# EAGLE schematic cblockyeesh (EAGLE 6.6.0)
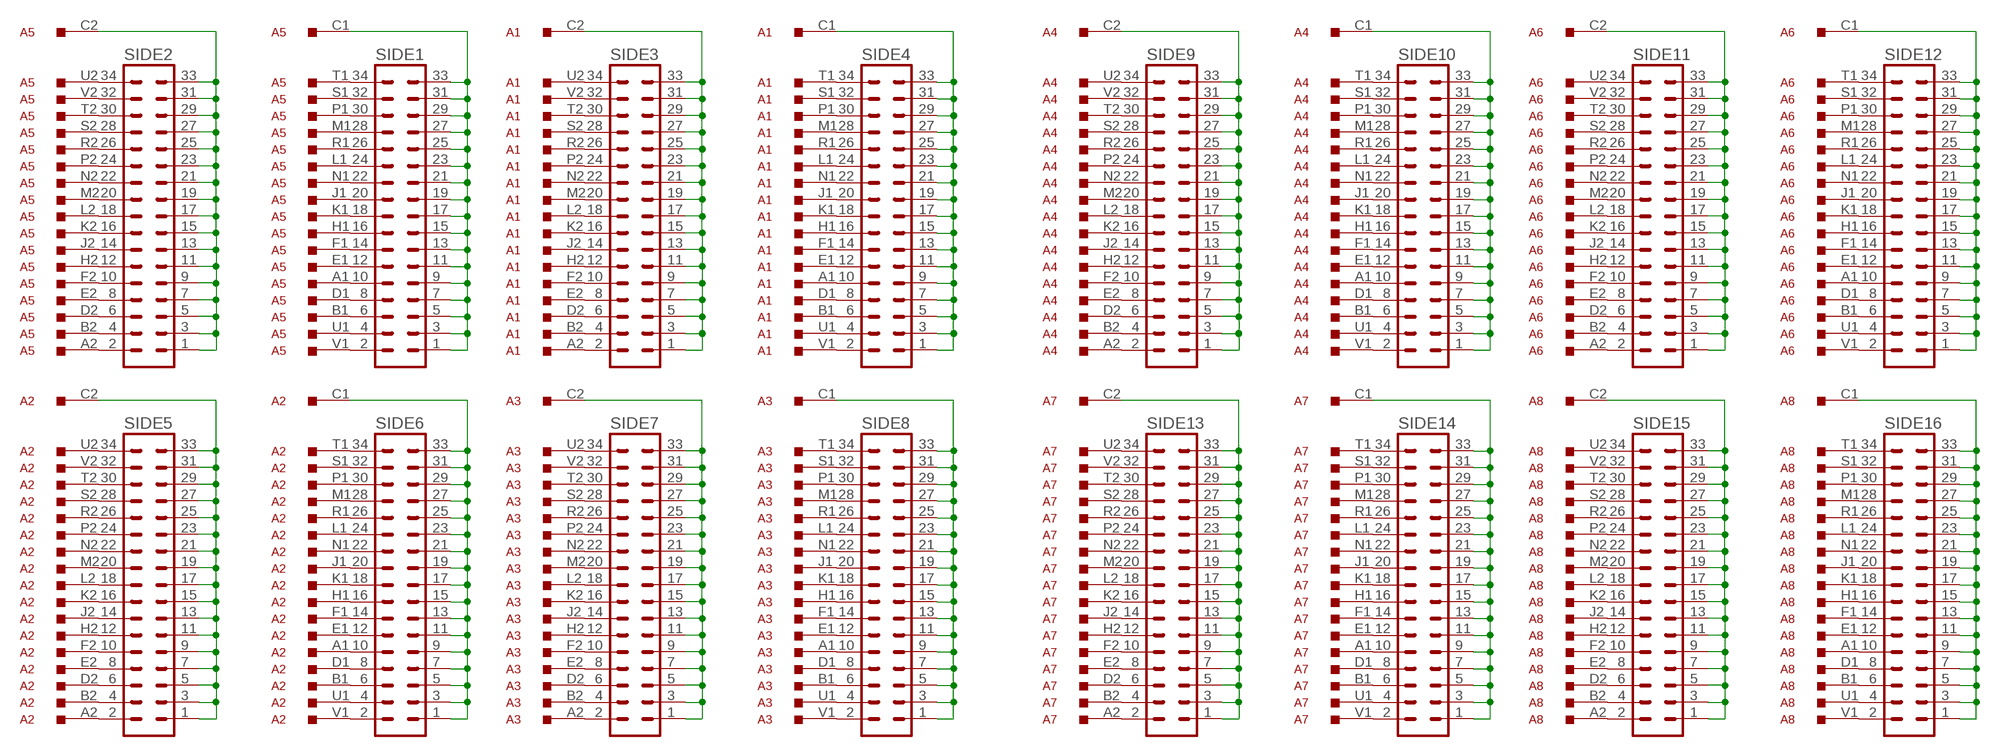
[diagram p0: schematic, sheet 1]

## Parts
A1  M916  [H807]
A2  M916  [H807]
A3  M916  [H807]
A4  M916  [H807]
A5  M916  [H807]
A6  M916  [H807]
A7  M916  [H807]
A8  M916  [H807]
SIDE1  MA17-2  [MA17-2]
SIDE2  MA17-2  [MA17-2]
SIDE3  MA17-2  [MA17-2]
SIDE4  MA17-2  [MA17-2]
SIDE5  MA17-2  [MA17-2]
SIDE6  MA17-2  [MA17-2]
SIDE7  MA17-2  [MA17-2]
SIDE8  MA17-2  [MA17-2]
SIDE9  MA17-2  [MA17-2]
SIDE10  MA17-2  [MA17-2]
SIDE11  MA17-2  [MA17-2]
SIDE12  MA17-2  [MA17-2]
SIDE13  MA17-2  [MA17-2]
SIDE14  MA17-2  [MA17-2]
SIDE15  MA17-2  [MA17-2]
SIDE16  MA17-2  [MA17-2]

## Nets
N$1: A5.C2 SIDE2.1 SIDE2.3 SIDE2.5 SIDE2.7 SIDE2.9 SIDE2.11 SIDE2.13 SIDE2.15 SIDE2.17 SIDE2.19 SIDE2.21 SIDE2.23 SIDE2.25 SIDE2.27 SIDE2.29 SIDE2.31 SIDE2.33
N$2: A5.A2 SIDE2.2
N$3: A5.B2 SIDE2.4
N$4: A5.D2 SIDE2.6
N$5: A5.E2 SIDE2.8
N$6: A5.F2 SIDE2.10
N$7: A5.H2 SIDE2.12
N$8: A5.J2 SIDE2.14
N$9: A5.K2 SIDE2.16
N$10: A5.L2 SIDE2.18
N$11: A5.M2 SIDE2.20
N$12: A5.N2 SIDE2.22
N$13: A5.P2 SIDE2.24
N$14: A5.R2 SIDE2.26
N$15: A5.S2 SIDE2.28
N$16: A5.T2 SIDE2.30
N$17: A5.U2 SIDE2.34
N$18: A5.V2 SIDE2.32
N$19: A5.A1 SIDE1.10
N$20: A5.B1 SIDE1.6
N$21: A5.D1 SIDE1.8
N$22: A5.E1 SIDE1.12
N$23: A5.F1 SIDE1.14
N$24: A5.H1 SIDE1.16
N$25: A5.J1 SIDE1.20
N$26: A5.K1 SIDE1.18
N$27: A5.L1 SIDE1.24
N$28: A5.M1 SIDE1.28
N$29: A5.N1 SIDE1.22
N$30: A5.P1 SIDE1.30
N$31: A5.R1 SIDE1.26
N$32: A5.S1 SIDE1.32
N$33: A5.T1 SIDE1.34
N$34: A5.U1 SIDE1.4
N$35: A5.V1 SIDE1.2
N$36: A5.C1 SIDE1.1 SIDE1.3 SIDE1.5 SIDE1.7 SIDE1.9 SIDE1.11 SIDE1.13 SIDE1.15 SIDE1.17 SIDE1.19 SIDE1.21 SIDE1.23 SIDE1.25 SIDE1.27 SIDE1.29 SIDE1.31 SIDE1.33
N$37: A1.C2 SIDE3.1 SIDE3.3 SIDE3.5 SIDE3.7 SIDE3.9 SIDE3.11 SIDE3.13 SIDE3.15 SIDE3.17 SIDE3.19 SIDE3.21 SIDE3.23 SIDE3.25 SIDE3.27 SIDE3.29 SIDE3.31 SIDE3.33
N$38: A1.A2 SIDE3.2
N$39: A1.B2 SIDE3.4
N$40: A1.D2 SIDE3.6
N$41: A1.E2 SIDE3.8
N$42: A1.F2 SIDE3.10
N$43: A1.H2 SIDE3.12
N$44: A1.J2 SIDE3.14
N$45: A1.K2 SIDE3.16
N$46: A1.L2 SIDE3.18
N$47: A1.M2 SIDE3.20
N$48: A1.N2 SIDE3.22
N$49: A1.P2 SIDE3.24
N$50: A1.R2 SIDE3.26
N$51: A1.S2 SIDE3.28
N$52: A1.T2 SIDE3.30
N$53: A1.U2 SIDE3.34
N$54: A1.V2 SIDE3.32
N$55: A1.A1 SIDE4.10
N$56: A1.B1 SIDE4.6
N$57: A1.D1 SIDE4.8
N$58: A1.E1 SIDE4.12
N$59: A1.F1 SIDE4.14
N$60: A1.H1 SIDE4.16
N$61: A1.J1 SIDE4.20
N$62: A1.K1 SIDE4.18
N$63: A1.L1 SIDE4.24
N$64: A1.M1 SIDE4.28
N$65: A1.N1 SIDE4.22
N$66: A1.P1 SIDE4.30
N$67: A1.R1 SIDE4.26
N$68: A1.S1 SIDE4.32
N$69: A1.T1 SIDE4.34
N$70: A1.U1 SIDE4.4
N$71: A1.V1 SIDE4.2
N$72: A1.C1 SIDE4.1 SIDE4.3 SIDE4.5 SIDE4.7 SIDE4.9 SIDE4.11 SIDE4.13 SIDE4.15 SIDE4.17 SIDE4.19 SIDE4.21 SIDE4.23 SIDE4.25 SIDE4.27 SIDE4.29 SIDE4.31 SIDE4.33
N$73: A2.C2 SIDE5.1 SIDE5.3 SIDE5.5 SIDE5.7 SIDE5.9 SIDE5.11 SIDE5.13 SIDE5.15 SIDE5.17 SIDE5.19 SIDE5.21 SIDE5.23 SIDE5.25 SIDE5.27 SIDE5.29 SIDE5.31 SIDE5.33
N$74: A2.A2 SIDE5.2
N$75: A2.B2 SIDE5.4
N$76: A2.D2 SIDE5.6
N$77: A2.E2 SIDE5.8
N$78: A2.F2 SIDE5.10
N$79: A2.H2 SIDE5.12
N$80: A2.J2 SIDE5.14
N$81: A2.K2 SIDE5.16
N$82: A2.L2 SIDE5.18
N$83: A2.M2 SIDE5.20
N$84: A2.N2 SIDE5.22
N$85: A2.P2 SIDE5.24
N$86: A2.R2 SIDE5.26
N$87: A2.S2 SIDE5.28
N$88: A2.T2 SIDE5.30
N$89: A2.U2 SIDE5.34
N$90: A2.V2 SIDE5.32
N$91: A2.A1 SIDE6.10
N$92: A2.B1 SIDE6.6
N$93: A2.D1 SIDE6.8
N$94: A2.E1 SIDE6.12
N$95: A2.F1 SIDE6.14
N$96: A2.H1 SIDE6.16
N$97: A2.J1 SIDE6.20
N$98: A2.K1 SIDE6.18
N$99: A2.L1 SIDE6.24
N$100: A2.M1 SIDE6.28
N$101: A2.N1 SIDE6.22
N$102: A2.P1 SIDE6.30
N$103: A2.R1 SIDE6.26
N$104: A2.S1 SIDE6.32
N$105: A2.T1 SIDE6.34
N$106: A2.U1 SIDE6.4
N$107: A2.V1 SIDE6.2
N$108: A2.C1 SIDE6.1 SIDE6.3 SIDE6.5 SIDE6.7 SIDE6.9 SIDE6.11 SIDE6.13 SIDE6.15 SIDE6.17 SIDE6.19 SIDE6.21 SIDE6.23 SIDE6.25 SIDE6.27 SIDE6.29 SIDE6.31 SIDE6.33
N$109: A3.C2 SIDE7.1 SIDE7.3 SIDE7.5 SIDE7.7 SIDE7.9 SIDE7.11 SIDE7.13 SIDE7.15 SIDE7.17 SIDE7.19 SIDE7.21 SIDE7.23 SIDE7.25 SIDE7.27 SIDE7.29 SIDE7.31 SIDE7.33
N$110: A3.A2 SIDE7.2
N$111: A3.B2 SIDE7.4
N$112: A3.D2 SIDE7.6
N$113: A3.E2 SIDE7.8
N$114: A3.F2 SIDE7.10
N$115: A3.H2 SIDE7.12
N$116: A3.J2 SIDE7.14
N$117: A3.K2 SIDE7.16
N$118: A3.L2 SIDE7.18
N$119: A3.M2 SIDE7.20
N$120: A3.N2 SIDE7.22
N$121: A3.P2 SIDE7.24
N$122: A3.R2 SIDE7.26
N$123: A3.S2 SIDE7.28
N$124: A3.T2 SIDE7.30
N$125: A3.U2 SIDE7.34
N$126: A3.V2 SIDE7.32
N$127: A3.A1 SIDE8.10
N$128: A3.B1 SIDE8.6
N$129: A3.D1 SIDE8.8
N$130: A3.E1 SIDE8.12
N$131: A3.F1 SIDE8.14
N$132: A3.H1 SIDE8.16
N$133: A3.J1 SIDE8.20
N$134: A3.K1 SIDE8.18
N$135: A3.L1 SIDE8.24
N$136: A3.M1 SIDE8.28
N$137: A3.N1 SIDE8.22
N$138: A3.P1 SIDE8.30
N$139: A3.R1 SIDE8.26
N$140: A3.S1 SIDE8.32
N$141: A3.T1 SIDE8.34
N$142: A3.U1 SIDE8.4
N$143: A3.V1 SIDE8.2
N$144: A3.C1 SIDE8.1 SIDE8.3 SIDE8.5 SIDE8.7 SIDE8.9 SIDE8.11 SIDE8.13 SIDE8.15 SIDE8.17 SIDE8.19 SIDE8.21 SIDE8.23 SIDE8.25 SIDE8.27 SIDE8.29 SIDE8.31 SIDE8.33
N$145: A4.C2 SIDE9.1 SIDE9.3 SIDE9.5 SIDE9.7 SIDE9.9 SIDE9.11 SIDE9.13 SIDE9.15 SIDE9.17 SIDE9.19 SIDE9.21 SIDE9.23 SIDE9.25 SIDE9.27 SIDE9.29 SIDE9.31 SIDE9.33
N$146: A4.A2 SIDE9.2
N$147: A4.B2 SIDE9.4
N$148: A4.D2 SIDE9.6
N$149: A4.E2 SIDE9.8
N$150: A4.F2 SIDE9.10
N$151: A4.H2 SIDE9.12
N$152: A4.J2 SIDE9.14
N$153: A4.K2 SIDE9.16
N$154: A4.L2 SIDE9.18
N$155: A4.M2 SIDE9.20
N$156: A4.N2 SIDE9.22
N$157: A4.P2 SIDE9.24
N$158: A4.R2 SIDE9.26
N$159: A4.S2 SIDE9.28
N$160: A4.T2 SIDE9.30
N$161: A4.U2 SIDE9.34
N$162: A4.V2 SIDE9.32
N$163: A4.A1 SIDE10.10
N$164: A4.B1 SIDE10.6
N$165: A4.D1 SIDE10.8
N$166: A4.E1 SIDE10.12
N$167: A4.F1 SIDE10.14
N$168: A4.H1 SIDE10.16
N$169: A4.J1 SIDE10.20
N$170: A4.K1 SIDE10.18
N$171: A4.L1 SIDE10.24
N$172: A4.M1 SIDE10.28
N$173: A4.N1 SIDE10.22
N$174: A4.P1 SIDE10.30
N$175: A4.R1 SIDE10.26
N$176: A4.S1 SIDE10.32
N$177: A4.T1 SIDE10.34
N$178: A4.U1 SIDE10.4
N$179: A4.V1 SIDE10.2
N$180: A4.C1 SIDE10.1 SIDE10.3 SIDE10.5 SIDE10.7 SIDE10.9 SIDE10.11 SIDE10.13 SIDE10.15 SIDE10.17 SIDE10.19 SIDE10.21 SIDE10.23 SIDE10.25 SIDE10.27 SIDE10.29 SIDE10.31 SIDE10.33
N$181: A6.C2 SIDE11.1 SIDE11.3 SIDE11.5 SIDE11.7 SIDE11.9 SIDE11.11 SIDE11.13 SIDE11.15 SIDE11.17 SIDE11.19 SIDE11.21 SIDE11.23 SIDE11.25 SIDE11.27 SIDE11.29 SIDE11.31 SIDE11.33
N$182: A6.A2 SIDE11.2
N$183: A6.B2 SIDE11.4
N$184: A6.D2 SIDE11.6
N$185: A6.E2 SIDE11.8
N$186: A6.F2 SIDE11.10
N$187: A6.H2 SIDE11.12
N$188: A6.J2 SIDE11.14
N$189: A6.K2 SIDE11.16
N$190: A6.L2 SIDE11.18
N$191: A6.M2 SIDE11.20
N$192: A6.N2 SIDE11.22
N$193: A6.P2 SIDE11.24
N$194: A6.R2 SIDE11.26
N$195: A6.S2 SIDE11.28
N$196: A6.T2 SIDE11.30
N$197: A6.U2 SIDE11.34
N$198: A6.V2 SIDE11.32
N$199: A6.A1 SIDE12.10
N$200: A6.B1 SIDE12.6
N$201: A6.D1 SIDE12.8
N$202: A6.E1 SIDE12.12
N$203: A6.F1 SIDE12.14
N$204: A6.H1 SIDE12.16
N$205: A6.J1 SIDE12.20
N$206: A6.K1 SIDE12.18
N$207: A6.L1 SIDE12.24
N$208: A6.M1 SIDE12.28
N$209: A6.N1 SIDE12.22
N$210: A6.P1 SIDE12.30
N$211: A6.R1 SIDE12.26
N$212: A6.S1 SIDE12.32
N$213: A6.T1 SIDE12.34
N$214: A6.U1 SIDE12.4
N$215: A6.V1 SIDE12.2
N$216: A6.C1 SIDE12.1 SIDE12.3 SIDE12.5 SIDE12.7 SIDE12.9 SIDE12.11 SIDE12.13 SIDE12.15 SIDE12.17 SIDE12.19 SIDE12.21 SIDE12.23 SIDE12.25 SIDE12.27 SIDE12.29 SIDE12.31 SIDE12.33
N$217: A7.C2 SIDE13.1 SIDE13.3 SIDE13.5 SIDE13.7 SIDE13.9 SIDE13.11 SIDE13.13 SIDE13.15 SIDE13.17 SIDE13.19 SIDE13.21 SIDE13.23 SIDE13.25 SIDE13.27 SIDE13.29 SIDE13.31 SIDE13.33
N$218: A7.A2 SIDE13.2
N$219: A7.B2 SIDE13.4
N$220: A7.D2 SIDE13.6
N$221: A7.E2 SIDE13.8
N$222: A7.F2 SIDE13.10
N$223: A7.H2 SIDE13.12
N$224: A7.J2 SIDE13.14
N$225: A7.K2 SIDE13.16
N$226: A7.L2 SIDE13.18
N$227: A7.M2 SIDE13.20
N$228: A7.N2 SIDE13.22
N$229: A7.P2 SIDE13.24
N$230: A7.R2 SIDE13.26
N$231: A7.S2 SIDE13.28
N$232: A7.T2 SIDE13.30
N$233: A7.U2 SIDE13.34
N$234: A7.V2 SIDE13.32
N$235: A7.A1 SIDE14.10
N$236: A7.B1 SIDE14.6
N$237: A7.D1 SIDE14.8
N$238: A7.E1 SIDE14.12
N$239: A7.F1 SIDE14.14
N$240: A7.H1 SIDE14.16
N$241: A7.J1 SIDE14.20
N$242: A7.K1 SIDE14.18
N$243: A7.L1 SIDE14.24
N$244: A7.M1 SIDE14.28
N$245: A7.N1 SIDE14.22
N$246: A7.P1 SIDE14.30
N$247: A7.R1 SIDE14.26
N$248: A7.S1 SIDE14.32
N$249: A7.T1 SIDE14.34
N$250: A7.U1 SIDE14.4
N$251: A7.V1 SIDE14.2
N$252: A7.C1 SIDE14.1 SIDE14.3 SIDE14.5 SIDE14.7 SIDE14.9 SIDE14.11 SIDE14.13 SIDE14.15 SIDE14.17 SIDE14.19 SIDE14.21 SIDE14.23 SIDE14.25 SIDE14.27 SIDE14.29 SIDE14.31 SIDE14.33
N$253: A8.C2 SIDE15.1 SIDE15.3 SIDE15.5 SIDE15.7 SIDE15.9 SIDE15.11 SIDE15.13 SIDE15.15 SIDE15.17 SIDE15.19 SIDE15.21 SIDE15.23 SIDE15.25 SIDE15.27 SIDE15.29 SIDE15.31 SIDE15.33
N$254: A8.A2 SIDE15.2
N$255: A8.B2 SIDE15.4
N$256: A8.D2 SIDE15.6
N$257: A8.E2 SIDE15.8
N$258: A8.F2 SIDE15.10
N$259: A8.H2 SIDE15.12
N$260: A8.J2 SIDE15.14
N$261: A8.K2 SIDE15.16
N$262: A8.L2 SIDE15.18
N$263: A8.M2 SIDE15.20
N$264: A8.N2 SIDE15.22
N$265: A8.P2 SIDE15.24
N$266: A8.R2 SIDE15.26
N$267: A8.S2 SIDE15.28
N$268: A8.T2 SIDE15.30
N$269: A8.U2 SIDE15.34
N$270: A8.V2 SIDE15.32
N$271: A8.A1 SIDE16.10
N$272: A8.B1 SIDE16.6
N$273: A8.D1 SIDE16.8
N$274: A8.E1 SIDE16.12
N$275: A8.F1 SIDE16.14
N$276: A8.H1 SIDE16.16
N$277: A8.J1 SIDE16.20
N$278: A8.K1 SIDE16.18
N$279: A8.L1 SIDE16.24
N$280: A8.M1 SIDE16.28
N$281: A8.N1 SIDE16.22
N$282: A8.P1 SIDE16.30
N$283: A8.R1 SIDE16.26
N$284: A8.S1 SIDE16.32
N$285: A8.T1 SIDE16.34
N$286: A8.U1 SIDE16.4
N$287: A8.V1 SIDE16.2
N$288: A8.C1 SIDE16.1 SIDE16.3 SIDE16.5 SIDE16.7 SIDE16.9 SIDE16.11 SIDE16.13 SIDE16.15 SIDE16.17 SIDE16.19 SIDE16.21 SIDE16.23 SIDE16.25 SIDE16.27 SIDE16.29 SIDE16.31 SIDE16.33

## Library data of the parts
A1-A8 = dec-m:M916: Simple 36 pin connector/wire cable
SIDE1-SIDE16 = con-lstb:MA17-2: PIN HEADER; OC_FARNELL: unknown; OC_NEWARK: unknown

## Net classes
1 Power: width 0.305 mm, clearance 0.305 mm